# EAGLE schematic Rear Logic (EAGLE 6.5.0)
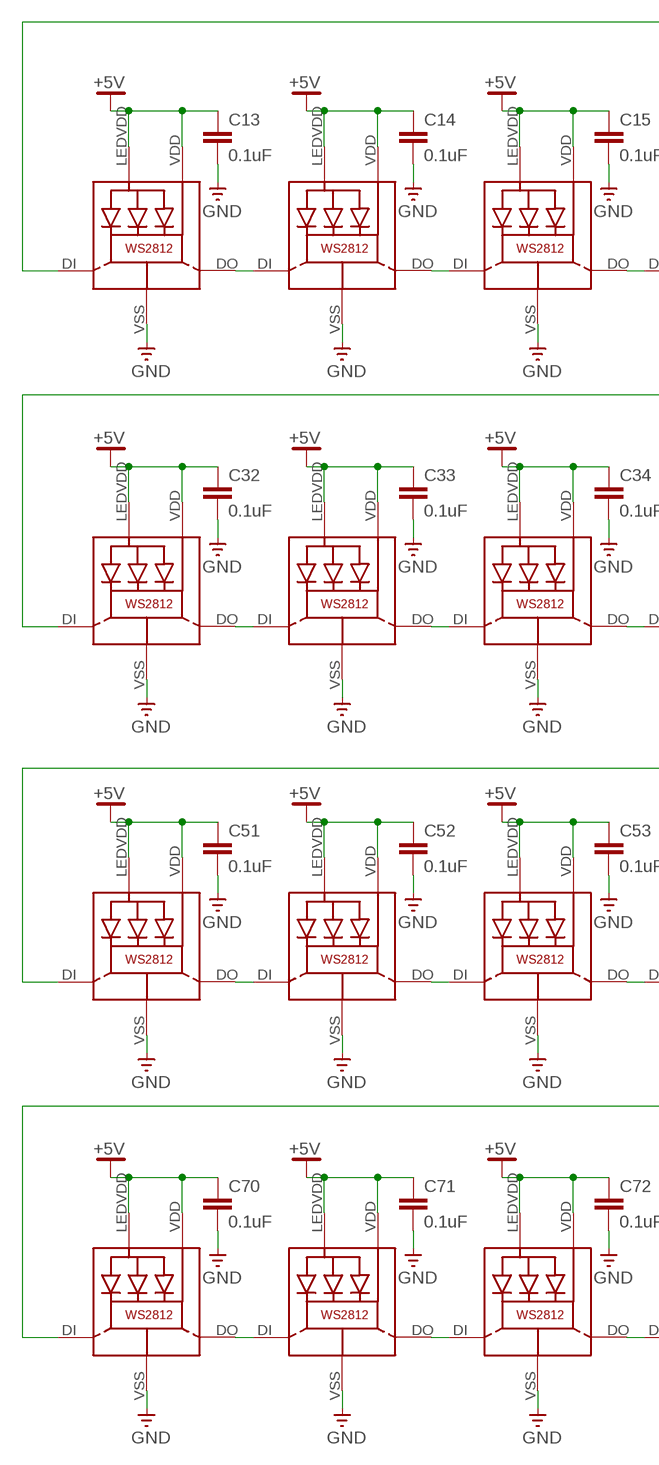
[diagram p0: schematic, sheet 1, part 1 of 2]
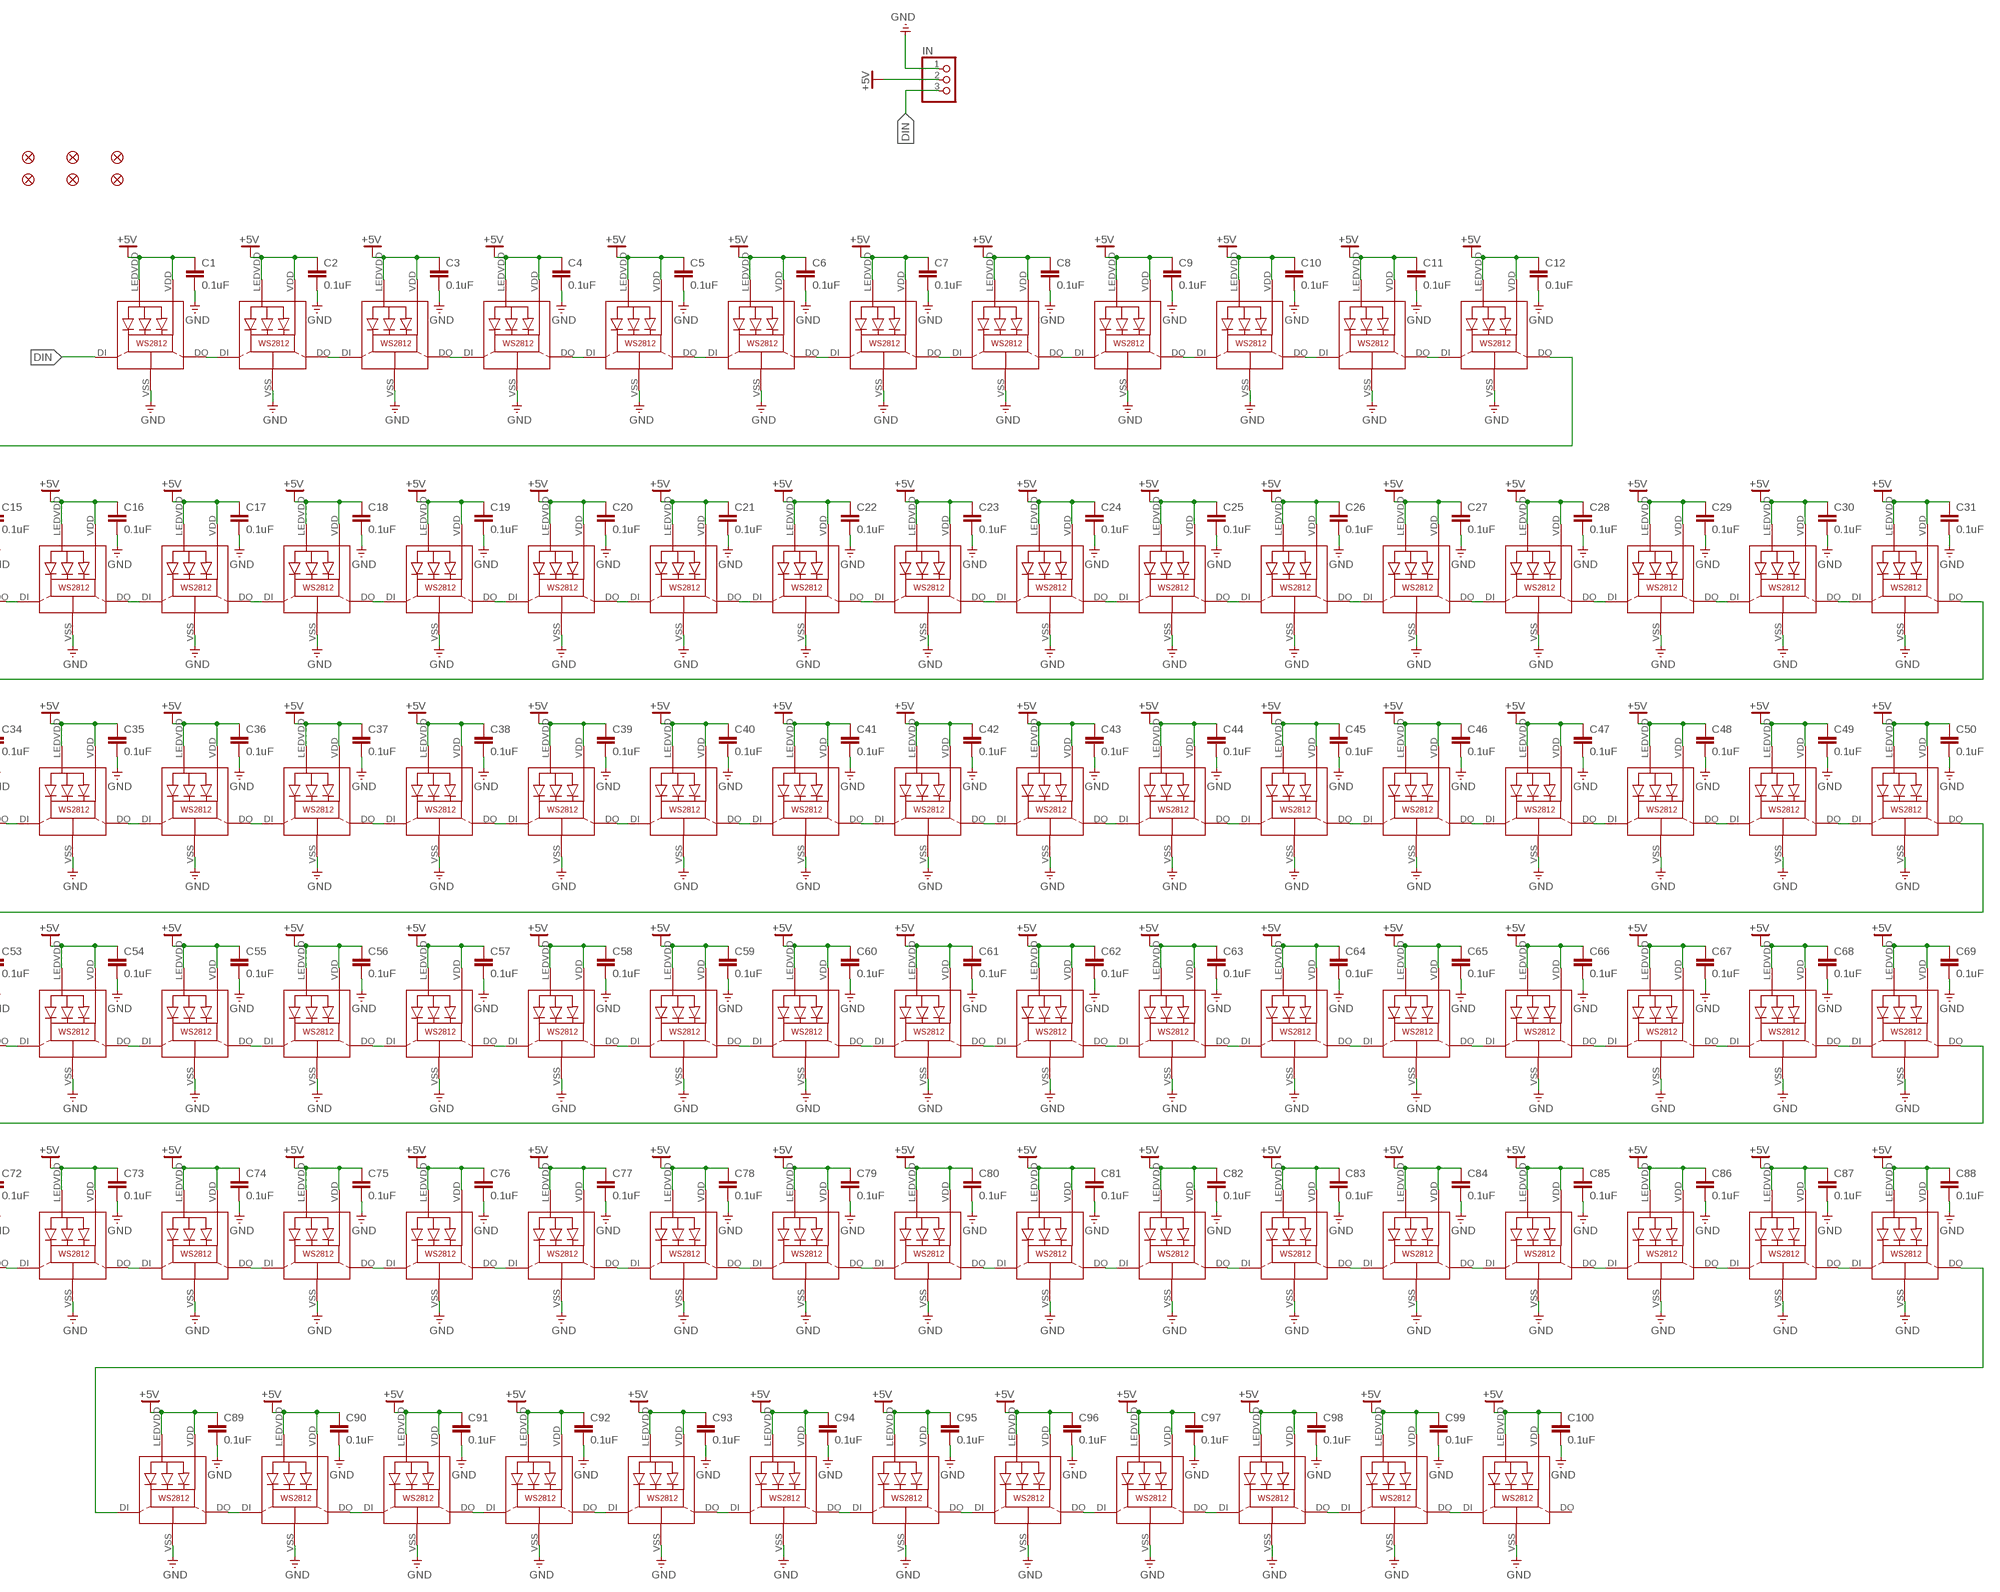
[diagram p1: schematic, sheet 1, part 2 of 2]

## Parts
C1  0.1uF  CAP0805  [0805]
C2  0.1uF  CAP0805  [0805]
C3  0.1uF  CAP0805  [0805]
C4  0.1uF  CAP0805  [0805]
C5  0.1uF  CAP0805  [0805]
C6  0.1uF  CAP0805  [0805]
C7  0.1uF  CAP0805  [0805]
C8  0.1uF  CAP0805  [0805]
C9  0.1uF  CAP0805  [0805]
C10  0.1uF  CAP0805  [0805]
C11  0.1uF  CAP0805  [0805]
C12  0.1uF  CAP0805  [0805]
C13  0.1uF  CAP0805  [0805]
C14  0.1uF  CAP0805  [0805]
C15  0.1uF  CAP0805  [0805]
C16  0.1uF  CAP0805  [0805]
C17  0.1uF  CAP0805  [0805]
C18  0.1uF  CAP0805  [0805]
C19  0.1uF  CAP0805  [0805]
C20  0.1uF  CAP0805  [0805]
C21  0.1uF  CAP0805  [0805]
C22  0.1uF  CAP0805  [0805]
C23  0.1uF  CAP0805  [0805]
C24  0.1uF  CAP0805  [0805]
C25  0.1uF  CAP0805  [0805]
C26  0.1uF  CAP0805  [0805]
C27  0.1uF  CAP0805  [0805]
C28  0.1uF  CAP0805  [0805]
C29  0.1uF  CAP0805  [0805]
C30  0.1uF  CAP0805  [0805]
C31  0.1uF  CAP0805  [0805]
C32  0.1uF  CAP0805  [0805]
C33  0.1uF  CAP0805  [0805]
C34  0.1uF  CAP0805  [0805]
C35  0.1uF  CAP0805  [0805]
C36  0.1uF  CAP0805  [0805]
C37  0.1uF  CAP0805  [0805]
C38  0.1uF  CAP0805  [0805]
C39  0.1uF  CAP0805  [0805]
C40  0.1uF  CAP0805  [0805]
C41  0.1uF  CAP0805  [0805]
C42  0.1uF  CAP0805  [0805]
C43  0.1uF  CAP0805  [0805]
C44  0.1uF  CAP0805  [0805]
C45  0.1uF  CAP0805  [0805]
C46  0.1uF  CAP0805  [0805]
C47  0.1uF  CAP0805  [0805]
C48  0.1uF  CAP0805  [0805]
C49  0.1uF  CAP0805  [0805]
C50  0.1uF  CAP0805  [0805]
C51  0.1uF  CAP0805  [0805]
C52  0.1uF  CAP0805  [0805]
C53  0.1uF  CAP0805  [0805]
C54  0.1uF  CAP0805  [0805]
C55  0.1uF  CAP0805  [0805]
C56  0.1uF  CAP0805  [0805]
C57  0.1uF  CAP0805  [0805]
C58  0.1uF  CAP0805  [0805]
C59  0.1uF  CAP0805  [0805]
C60  0.1uF  CAP0805  [0805]
C61  0.1uF  CAP0805  [0805]
C62  0.1uF  CAP0805  [0805]
C63  0.1uF  CAP0805  [0805]
C64  0.1uF  CAP0805  [0805]
C65  0.1uF  CAP0805  [0805]
C66  0.1uF  CAP0805  [0805]
C67  0.1uF  CAP0805  [0805]
C68  0.1uF  CAP0805  [0805]
C69  0.1uF  CAP0805  [0805]
C70  0.1uF  CAP0805  [0805]
C71  0.1uF  CAP0805  [0805]
C72  0.1uF  CAP0805  [0805]
C73  0.1uF  CAP0805  [0805]
C74  0.1uF  CAP0805  [0805]
C75  0.1uF  CAP0805  [0805]
C76  0.1uF  CAP0805  [0805]
C77  0.1uF  CAP0805  [0805]
C78  0.1uF  CAP0805  [0805]
C79  0.1uF  CAP0805  [0805]
C80  0.1uF  CAP0805  [0805]
C81  0.1uF  CAP0805  [0805]
C82  0.1uF  CAP0805  [0805]
C83  0.1uF  CAP0805  [0805]
C84  0.1uF  CAP0805  [0805]
C85  0.1uF  CAP0805  [0805]
C86  0.1uF  CAP0805  [0805]
C87  0.1uF  CAP0805  [0805]
C88  0.1uF  CAP0805  [0805]
C89  0.1uF  CAP0805  [0805]
C90  0.1uF  CAP0805  [0805]
C91  0.1uF  CAP0805  [0805]
C92  0.1uF  CAP0805  [0805]
C93  0.1uF  CAP0805  [0805]
C94  0.1uF  CAP0805  [0805]
C95  0.1uF  CAP0805  [0805]
C96  0.1uF  CAP0805  [0805]
C97  0.1uF  CAP0805  [0805]
C98  0.1uF  CAP0805  [0805]
C99  0.1uF  CAP0805  [0805]
C100  0.1uF  CAP0805  [0805]
FID1  FIDUCIAL1.5X3  [FIDUCIAL-1.5X3]
FID2  FIDUCIAL1.5X3  [FIDUCIAL-1.5X3]
FID3  FIDUCIAL1.5X3  [FIDUCIAL-1.5X3]
FID4  FIDUCIAL1.5X3  [FIDUCIAL-1.5X3]
FID5  FIDUCIAL1.5X3  [FIDUCIAL-1.5X3]
FID6  FIDUCIAL1.5X3  [FIDUCIAL-1.5X3]
IN  PINHD-1X3  [1X03]
LED1  WS2812  [WS2812]
LED2  WS2812  [WS2812]
LED3  WS2812  [WS2812]
LED4  WS2812  [WS2812]
LED5  WS2812  [WS2812]
LED6  WS2812  [WS2812]
LED7  WS2812  [WS2812]
LED8  WS2812  [WS2812]
LED9  WS2812  [WS2812]
LED10  WS2812  [WS2812]
LED11  WS2812  [WS2812]
LED12  WS2812  [WS2812]
LED13  WS2812  [WS2812]
LED14  WS2812  [WS2812]
LED15  WS2812  [WS2812]
LED16  WS2812  [WS2812]
LED17  WS2812  [WS2812]
LED18  WS2812  [WS2812]
LED19  WS2812  [WS2812]
LED20  WS2812  [WS2812]
LED21  WS2812  [WS2812]
LED22  WS2812  [WS2812]
LED23  WS2812  [WS2812]
LED24  WS2812  [WS2812]
LED25  WS2812  [WS2812]
LED26  WS2812  [WS2812]
LED27  WS2812  [WS2812]
LED28  WS2812  [WS2812]
LED29  WS2812  [WS2812]
LED30  WS2812  [WS2812]
LED31  WS2812  [WS2812]
LED32  WS2812  [WS2812]
LED33  WS2812  [WS2812]
LED34  WS2812  [WS2812]
LED35  WS2812  [WS2812]
LED36  WS2812  [WS2812]
LED37  WS2812  [WS2812]
LED38  WS2812  [WS2812]
LED39  WS2812  [WS2812]
LED40  WS2812  [WS2812]
LED41  WS2812  [WS2812]
LED42  WS2812  [WS2812]
LED43  WS2812  [WS2812]
LED44  WS2812  [WS2812]
LED45  WS2812  [WS2812]
LED46  WS2812  [WS2812]
LED47  WS2812  [WS2812]
LED48  WS2812  [WS2812]
LED49  WS2812  [WS2812]
LED50  WS2812  [WS2812]
LED51  WS2812  [WS2812]
LED52  WS2812  [WS2812]
LED53  WS2812  [WS2812]
LED54  WS2812  [WS2812]
LED55  WS2812  [WS2812]
LED56  WS2812  [WS2812]
LED57  WS2812  [WS2812]
LED58  WS2812  [WS2812]
LED59  WS2812  [WS2812]
LED60  WS2812  [WS2812]
LED61  WS2812  [WS2812]
LED62  WS2812  [WS2812]
LED63  WS2812  [WS2812]
LED64  WS2812  [WS2812]
LED65  WS2812  [WS2812]
LED66  WS2812  [WS2812]
LED67  WS2812  [WS2812]
LED68  WS2812  [WS2812]
LED69  WS2812  [WS2812]
LED70  WS2812  [WS2812]
LED71  WS2812  [WS2812]
LED72  WS2812  [WS2812]
LED73  WS2812  [WS2812]
LED74  WS2812  [WS2812]
LED75  WS2812  [WS2812]
LED76  WS2812  [WS2812]
LED77  WS2812  [WS2812]
LED78  WS2812  [WS2812]
LED79  WS2812  [WS2812]
LED80  WS2812  [WS2812]
LED81  WS2812  [WS2812]
LED82  WS2812  [WS2812]
LED83  WS2812  [WS2812]
LED84  WS2812  [WS2812]
LED85  WS2812  [WS2812]
LED86  WS2812  [WS2812]
LED87  WS2812  [WS2812]
LED88  WS2812  [WS2812]
LED89  WS2812  [WS2812]
LED90  WS2812  [WS2812]
LED91  WS2812  [WS2812]
LED92  WS2812  [WS2812]
LED93  WS2812  [WS2812]
LED94  WS2812  [WS2812]
LED95  WS2812  [WS2812]
LED96  WS2812  [WS2812]
LED97  WS2812  [WS2812]
LED98  WS2812  [WS2812]
LED99  WS2812  [WS2812]
LED100  WS2812  [WS2812]

## Nets
+5V [supply]: C1.1 C2.1 C3.1 C4.1 C5.1 C6.1 C7.1 C8.1 C9.1 C10.1 C11.1 C12.1 C13.1 C14.1 C15.1 C16.1 C17.1 C18.1 C19.1 C20.1 C21.1 C22.1 C23.1 C24.1 C25.1 C26.1 C27.1 C28.1 C29.1 C30.1 C31.1 C32.1 C33.1 C34.1 C35.1 C36.1 C37.1 C38.1 C39.1 C40.1 C41.1 C42.1 C43.1 C44.1 C45.1 C46.1 C47.1 C48.1 C49.1 C50.1 C51.1 C52.1 C53.1 C54.1 C55.1 C56.1 C57.1 C58.1 C59.1 C60.1 C61.1 C62.1 C63.1 C64.1 C65.1 C66.1 C67.1 C68.1 C69.1 C70.1 C71.1 C72.1 C73.1 C74.1 C75.1 C76.1 C77.1 C78.1 C79.1 C80.1 C81.1 C82.1 C83.1 C84.1 C85.1 C86.1 C87.1 C88.1 C89.1 C90.1 C91.1 C92.1 C93.1 C94.1 C95.1 C96.1 C97.1 C98.1 C99.1 C100.1 IN.2 LED1.LEDVDD LED1.VDD LED2.LEDVDD LED2.VDD LED3.LEDVDD LED3.VDD LED4.LEDVDD LED4.VDD LED5.LEDVDD LED5.VDD LED6.LEDVDD LED6.VDD LED7.LEDVDD LED7.VDD LED8.LEDVDD LED8.VDD LED9.LEDVDD LED9.VDD LED10.LEDVDD LED10.VDD LED11.LEDVDD LED11.VDD LED12.LEDVDD LED12.VDD LED13.LEDVDD LED13.VDD LED14.LEDVDD LED14.VDD LED15.LEDVDD LED15.VDD LED16.LEDVDD LED16.VDD LED17.LEDVDD LED17.VDD LED18.LEDVDD LED18.VDD LED19.LEDVDD LED19.VDD LED20.LEDVDD LED20.VDD LED21.LEDVDD LED21.VDD LED22.LEDVDD LED22.VDD LED23.LEDVDD LED23.VDD LED24.LEDVDD LED24.VDD LED25.LEDVDD LED25.VDD LED26.LEDVDD LED26.VDD LED27.LEDVDD LED27.VDD LED28.LEDVDD LED28.VDD LED29.LEDVDD LED29.VDD LED30.LEDVDD LED30.VDD LED31.LEDVDD LED31.VDD LED32.LEDVDD LED32.VDD LED33.LEDVDD LED33.VDD LED34.LEDVDD LED34.VDD LED35.LEDVDD LED35.VDD LED36.LEDVDD LED36.VDD LED37.LEDVDD LED37.VDD LED38.LEDVDD LED38.VDD LED39.LEDVDD LED39.VDD LED40.LEDVDD LED40.VDD LED41.LEDVDD LED41.VDD LED42.LEDVDD LED42.VDD LED43.LEDVDD LED43.VDD LED44.LEDVDD LED44.VDD LED45.LEDVDD LED45.VDD LED46.LEDVDD LED46.VDD LED47.LEDVDD LED47.VDD LED48.LEDVDD LED48.VDD LED49.LEDVDD LED49.VDD LED50.LEDVDD LED50.VDD LED51.LEDVDD LED51.VDD LED52.LEDVDD LED52.VDD LED53.LEDVDD LED53.VDD LED54.LEDVDD LED54.VDD LED55.LEDVDD LED55.VDD LED56.LEDVDD LED56.VDD LED57.LEDVDD LED57.VDD LED58.LEDVDD LED58.VDD LED59.LEDVDD LED59.VDD LED60.LEDVDD LED60.VDD LED61.LEDVDD LED61.VDD LED62.LEDVDD LED62.VDD LED63.LEDVDD LED63.VDD LED64.LEDVDD LED64.VDD LED65.LEDVDD LED65.VDD LED66.LEDVDD LED66.VDD LED67.LEDVDD LED67.VDD LED68.LEDVDD LED68.VDD LED69.LEDVDD LED69.VDD LED70.LEDVDD LED70.VDD LED71.LEDVDD LED71.VDD LED72.LEDVDD LED72.VDD LED73.LEDVDD LED73.VDD LED74.LEDVDD LED74.VDD LED75.LEDVDD LED75.VDD LED76.LEDVDD LED76.VDD LED77.LEDVDD LED77.VDD LED78.LEDVDD LED78.VDD LED79.LEDVDD LED79.VDD LED80.LEDVDD LED80.VDD LED81.LEDVDD LED81.VDD LED82.LEDVDD LED82.VDD LED83.LEDVDD LED83.VDD LED84.LEDVDD LED84.VDD LED85.LEDVDD LED85.VDD LED86.LEDVDD LED86.VDD LED87.LEDVDD LED87.VDD LED88.LEDVDD LED88.VDD LED89.LEDVDD LED89.VDD LED90.LEDVDD LED90.VDD LED91.LEDVDD LED91.VDD LED92.LEDVDD LED92.VDD LED93.LEDVDD LED93.VDD LED94.LEDVDD LED94.VDD LED95.LEDVDD LED95.VDD LED96.LEDVDD LED96.VDD LED97.LEDVDD LED97.VDD LED98.LEDVDD LED98.VDD LED99.LEDVDD LED99.VDD LED100.LEDVDD LED100.VDD
DIN: IN.3 LED1.DI
GND [supply]: C1.2 C2.2 C3.2 C4.2 C5.2 C6.2 C7.2 C8.2 C9.2 C10.2 C11.2 C12.2 C13.2 C14.2 C15.2 C16.2 C17.2 C18.2 C19.2 C20.2 C21.2 C22.2 C23.2 C24.2 C25.2 C26.2 C27.2 C28.2 C29.2 C30.2 C31.2 C32.2 C33.2 C34.2 C35.2 C36.2 C37.2 C38.2 C39.2 C40.2 C41.2 C42.2 C43.2 C44.2 C45.2 C46.2 C47.2 C48.2 C49.2 C50.2 C51.2 C52.2 C53.2 C54.2 C55.2 C56.2 C57.2 C58.2 C59.2 C60.2 C61.2 C62.2 C63.2 C64.2 C65.2 C66.2 C67.2 C68.2 C69.2 C70.2 C71.2 C72.2 C73.2 C74.2 C75.2 C76.2 C77.2 C78.2 C79.2 C80.2 C81.2 C82.2 C83.2 C84.2 C85.2 C86.2 C87.2 C88.2 C89.2 C90.2 C91.2 C92.2 C93.2 C94.2 C95.2 C96.2 C97.2 C98.2 C99.2 C100.2 IN.1 LED1.VSS(GND) LED2.VSS(GND) LED3.VSS(GND) LED4.VSS(GND) LED5.VSS(GND) LED6.VSS(GND) LED7.VSS(GND) LED8.VSS(GND) LED9.VSS(GND) LED10.VSS(GND) LED11.VSS(GND) LED12.VSS(GND) LED13.VSS(GND) LED14.VSS(GND) LED15.VSS(GND) LED16.VSS(GND) LED17.VSS(GND) LED18.VSS(GND) LED19.VSS(GND) LED20.VSS(GND) LED21.VSS(GND) LED22.VSS(GND) LED23.VSS(GND) LED24.VSS(GND) LED25.VSS(GND) LED26.VSS(GND) LED27.VSS(GND) LED28.VSS(GND) LED29.VSS(GND) LED30.VSS(GND) LED31.VSS(GND) LED32.VSS(GND) LED33.VSS(GND) LED34.VSS(GND) LED35.VSS(GND) LED36.VSS(GND) LED37.VSS(GND) LED38.VSS(GND) LED39.VSS(GND) LED40.VSS(GND) LED41.VSS(GND) LED42.VSS(GND) LED43.VSS(GND) LED44.VSS(GND) LED45.VSS(GND) LED46.VSS(GND) LED47.VSS(GND) LED48.VSS(GND) LED49.VSS(GND) LED50.VSS(GND) LED51.VSS(GND) LED52.VSS(GND) LED53.VSS(GND) LED54.VSS(GND) LED55.VSS(GND) LED56.VSS(GND) LED57.VSS(GND) LED58.VSS(GND) LED59.VSS(GND) LED60.VSS(GND) LED61.VSS(GND) LED62.VSS(GND) LED63.VSS(GND) LED64.VSS(GND) LED65.VSS(GND) LED66.VSS(GND) LED67.VSS(GND) LED68.VSS(GND) LED69.VSS(GND) LED70.VSS(GND) LED71.VSS(GND) LED72.VSS(GND) LED73.VSS(GND) LED74.VSS(GND) LED75.VSS(GND) LED76.VSS(GND) LED77.VSS(GND) LED78.VSS(GND) LED79.VSS(GND) LED80.VSS(GND) LED81.VSS(GND) LED82.VSS(GND) LED83.VSS(GND) LED84.VSS(GND) LED85.VSS(GND) LED86.VSS(GND) LED87.VSS(GND) LED88.VSS(GND) LED89.VSS(GND) LED90.VSS(GND) LED91.VSS(GND) LED92.VSS(GND) LED93.VSS(GND) LED94.VSS(GND) LED95.VSS(GND) LED96.VSS(GND) LED97.VSS(GND) LED98.VSS(GND) LED99.VSS(GND) LED100.VSS(GND)
N$1: LED1.DO LED2.DI
N$2: LED3.DO LED4.DI
N$3: LED2.DO LED3.DI
N$4: LED5.DO LED6.DI
N$5: LED7.DO LED8.DI
N$6: LED6.DO LED7.DI
N$7: LED4.DO LED5.DI
N$8: LED9.DO LED10.DI
N$9: LED11.DO LED12.DI
N$10: LED10.DO LED11.DI
N$11: LED8.DO LED9.DI
N$12: LED13.DO LED14.DI
N$13: LED15.DO LED16.DI
N$14: LED14.DO LED15.DI
N$15: LED17.DO LED18.DI
N$16: LED19.DO LED20.DI
N$17: LED18.DO LED19.DI
N$18: LED16.DO LED17.DI
N$19: LED21.DO LED22.DI
N$20: LED23.DO LED24.DI
N$21: LED22.DO LED23.DI
N$22: LED20.DO LED21.DI
N$23: LED26.DO LED27.DI
N$24: LED25.DO LED26.DI
N$25: LED28.DO LED29.DI
N$26: LED30.DO LED31.DI
N$27: LED29.DO LED30.DI
N$28: LED27.DO LED28.DI
N$29: LED24.DO LED25.DI
N$30: LED32.DO LED33.DI
N$31: LED34.DO LED35.DI
N$32: LED33.DO LED34.DI
N$33: LED36.DO LED37.DI
N$34: LED38.DO LED39.DI
N$35: LED37.DO LED38.DI
N$36: LED35.DO LED36.DI
N$37: LED40.DO LED41.DI
N$38: LED42.DO LED43.DI
N$39: LED41.DO LED42.DI
N$40: LED39.DO LED40.DI
N$41: LED45.DO LED46.DI
N$42: LED44.DO LED45.DI
N$43: LED47.DO LED48.DI
N$44: LED49.DO LED50.DI
N$45: LED48.DO LED49.DI
N$46: LED46.DO LED47.DI
N$47: LED43.DO LED44.DI
N$48: LED51.DO LED52.DI
N$49: LED53.DO LED54.DI
N$50: LED52.DO LED53.DI
N$51: LED55.DO LED56.DI
N$52: LED57.DO LED58.DI
N$53: LED56.DO LED57.DI
N$54: LED54.DO LED55.DI
N$55: LED59.DO LED60.DI
N$56: LED61.DO LED62.DI
N$57: LED60.DO LED61.DI
N$58: LED58.DO LED59.DI
N$59: LED64.DO LED65.DI
N$60: LED63.DO LED64.DI
N$61: LED66.DO LED67.DI
N$62: LED68.DO LED69.DI
N$63: LED67.DO LED68.DI
N$64: LED65.DO LED66.DI
N$65: LED62.DO LED63.DI
N$66: LED70.DO LED71.DI
N$67: LED72.DO LED73.DI
N$68: LED71.DO LED72.DI
N$69: LED74.DO LED75.DI
N$70: LED76.DO LED77.DI
N$71: LED75.DO LED76.DI
N$72: LED73.DO LED74.DI
N$73: LED78.DO LED79.DI
N$74: LED80.DO LED81.DI
N$75: LED79.DO LED80.DI
N$76: LED77.DO LED78.DI
N$77: LED83.DO LED84.DI
N$78: LED82.DO LED83.DI
N$79: LED85.DO LED86.DI
N$80: LED87.DO LED88.DI
N$81: LED86.DO LED87.DI
N$82: LED84.DO LED85.DI
N$83: LED81.DO LED82.DI
N$84: LED89.DO LED90.DI
N$85: LED91.DO LED92.DI
N$86: LED90.DO LED91.DI
N$87: LED93.DO LED94.DI
N$88: LED95.DO LED96.DI
N$89: LED94.DO LED95.DI
N$90: LED92.DO LED93.DI
N$91: LED97.DO LED98.DI
N$92: LED99.DO LED100.DI
N$93: LED98.DO LED99.DI
N$94: LED96.DO LED97.DI
N$95: LED12.DO LED13.DI
N$96: LED31.DO LED32.DI
N$97: LED50.DO LED51.DI
N$98: LED69.DO LED70.DI
N$99: LED88.DO LED89.DI
Unconnected: LED100.DO

## Library data of the parts
C1-C100 = SparkFun-Capacitors:CAP: Capacitor Standard 0603 ceramic capacitor, and 0.1" leaded capacitor.
FID1-FID6 = SparkFun-Aesthetics:FIDUCIAL: Fiducial Alignment Points Various fiducial points for machine vision alignment.
IN = adafruit:PINHD-1X3: PIN HEADER
LED1-LED100 = rseries:WS2812

## Net classes
1 supply: width 0.406 mm, drill 0.33 mm, clearance 0.203 mm